# Altium schematic sheet EMU_adc.SchDoc
size A4
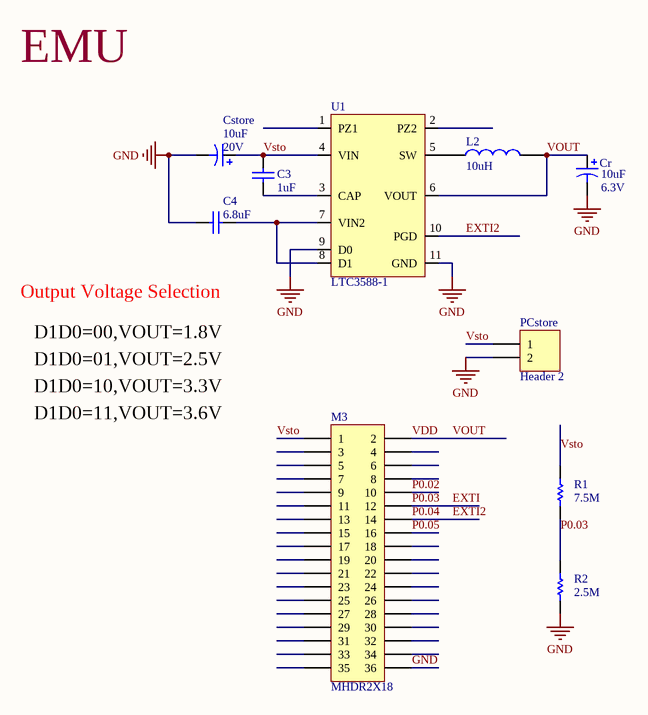
[diagram p0: EMU_adc.SchDoc]

## Parts
C3  value 1uF  [6-0805_N]  (hidden comment: CAP)
C4  value 6.8uF  [6-0805_N]  (hidden comment: CAP)
Cr  6.3V  value 10uF  [3216[1206]]
Cstore  value 10uF  Nominal Voltage: 20V  [钽电容]  (hidden comment: Cap Pol1)
L2  10uH  [1812]
M3  MHDR2X18  [module9x4]
PCstore  Header 2  [HDR1X2]
R1  value 7.5M  [6-0805_N]  (hidden comment: Res1)
R2  value 2.5M  [6-0805_N]  (hidden comment: Res1)
U1  LTC3588-1  [LTC 3588-1]

## Nets
GND: C4.2 Cr.2 Cstore.2 M3.36 PCstore.2 R2.1 U1.9(D0) U1.11(GND)
EXTI: M3.12 R1.1 R2.2  [also labelled P0.03]
EXTI2: M3.14 U1.10(PGD)  [also labelled P0.04]
P0.02: M3.10
P0.05: M3.16
VDD: Cr.1 L2.2 M3.2 U1.6(VOUT)  [also labelled VOUT]
Vsto: C3.2 Cstore.1 M3.1 PCstore.1 R1.2 U1.4(VIN)
NetC3_1: C3.1 U1.3(CAP)
NetC4_1: C4.1 U1.7(VIN2) U1.8(D1)
NetL2_1: L2.1 U1.5(SW)

Not connected (* = marked no-connect by the designer): M3 3 4 5 6 7 8 9 11 13 15 17 18 19 20 21 22 23 24 25 26 27 28 29 30 31 32 33 34 35; U1 1(PZ1) 2(PZ2)

## Notes on the sheet
- EMU
- Output Voltage Selection
- D1D0=00,VOUT=1.8V
- D1D0=01,VOUT=2.5V
- D1D0=10,VOUT=3.3V
- D1D0=11,VOUT=3.6V

## Library data of the parts
C3 C4 = CAP: Capacitor; Published: 8-Jun-2000; LatestRevisionDate: 17-Jul-2002; LatestRevisionNote: Re-released for DXP Platform.; PackageReference: RAD-0.3; Publisher: Altium Limited
Cr Cstore = Cap Pol1: Polarized Capacitor (Radial); Published: 8-Jun-2000; LatestRevisionDate: 17-Jul-2002; LatestRevisionNote: Re-released for DXP Platform.; PackageReference: RB7.6-15; Publisher: Altium Limited; PackageDescription: Polarized Capacitor (Radial); 2 Leads
L2 = INDUCTOR
M3 = MHDR2X18: Header, 18-Pin, Dual row; LatestRevisionDate: 17-Jul-2002; LatestRevisionNote: Re-released for DXP Platform.; Publisher: Altium Limited
PCstore = Header 2: Header, 2-Pin; LatestRevisionDate: 17-Jul-2002; LatestRevisionNote: Re-released for DXP Platform.; Publisher: Altium Limited
R1 R2 = Res1: Resistor; Published: 8-Jun-2000; LatestRevisionDate: 17-Jul-2002; LatestRevisionNote: Re-released for DXP Platform.; PackageReference: AXIAL-0.3; Publisher: Altium Limited; PackageDescription: Axial Device, Thru-Hole; 2 Leads; 0.3 in Pin Spacing
U1 = LTC3588-1: Nanopower energy harvesting power supply